# EasyEDA schematic SCH_LedGridWallHatV4_2026-08-28.json
TITLE: LED GRID WALL HAT; REV: 0.2; Date: 2026-05-31; Sheet: 1/1; Company: TimmonsLee
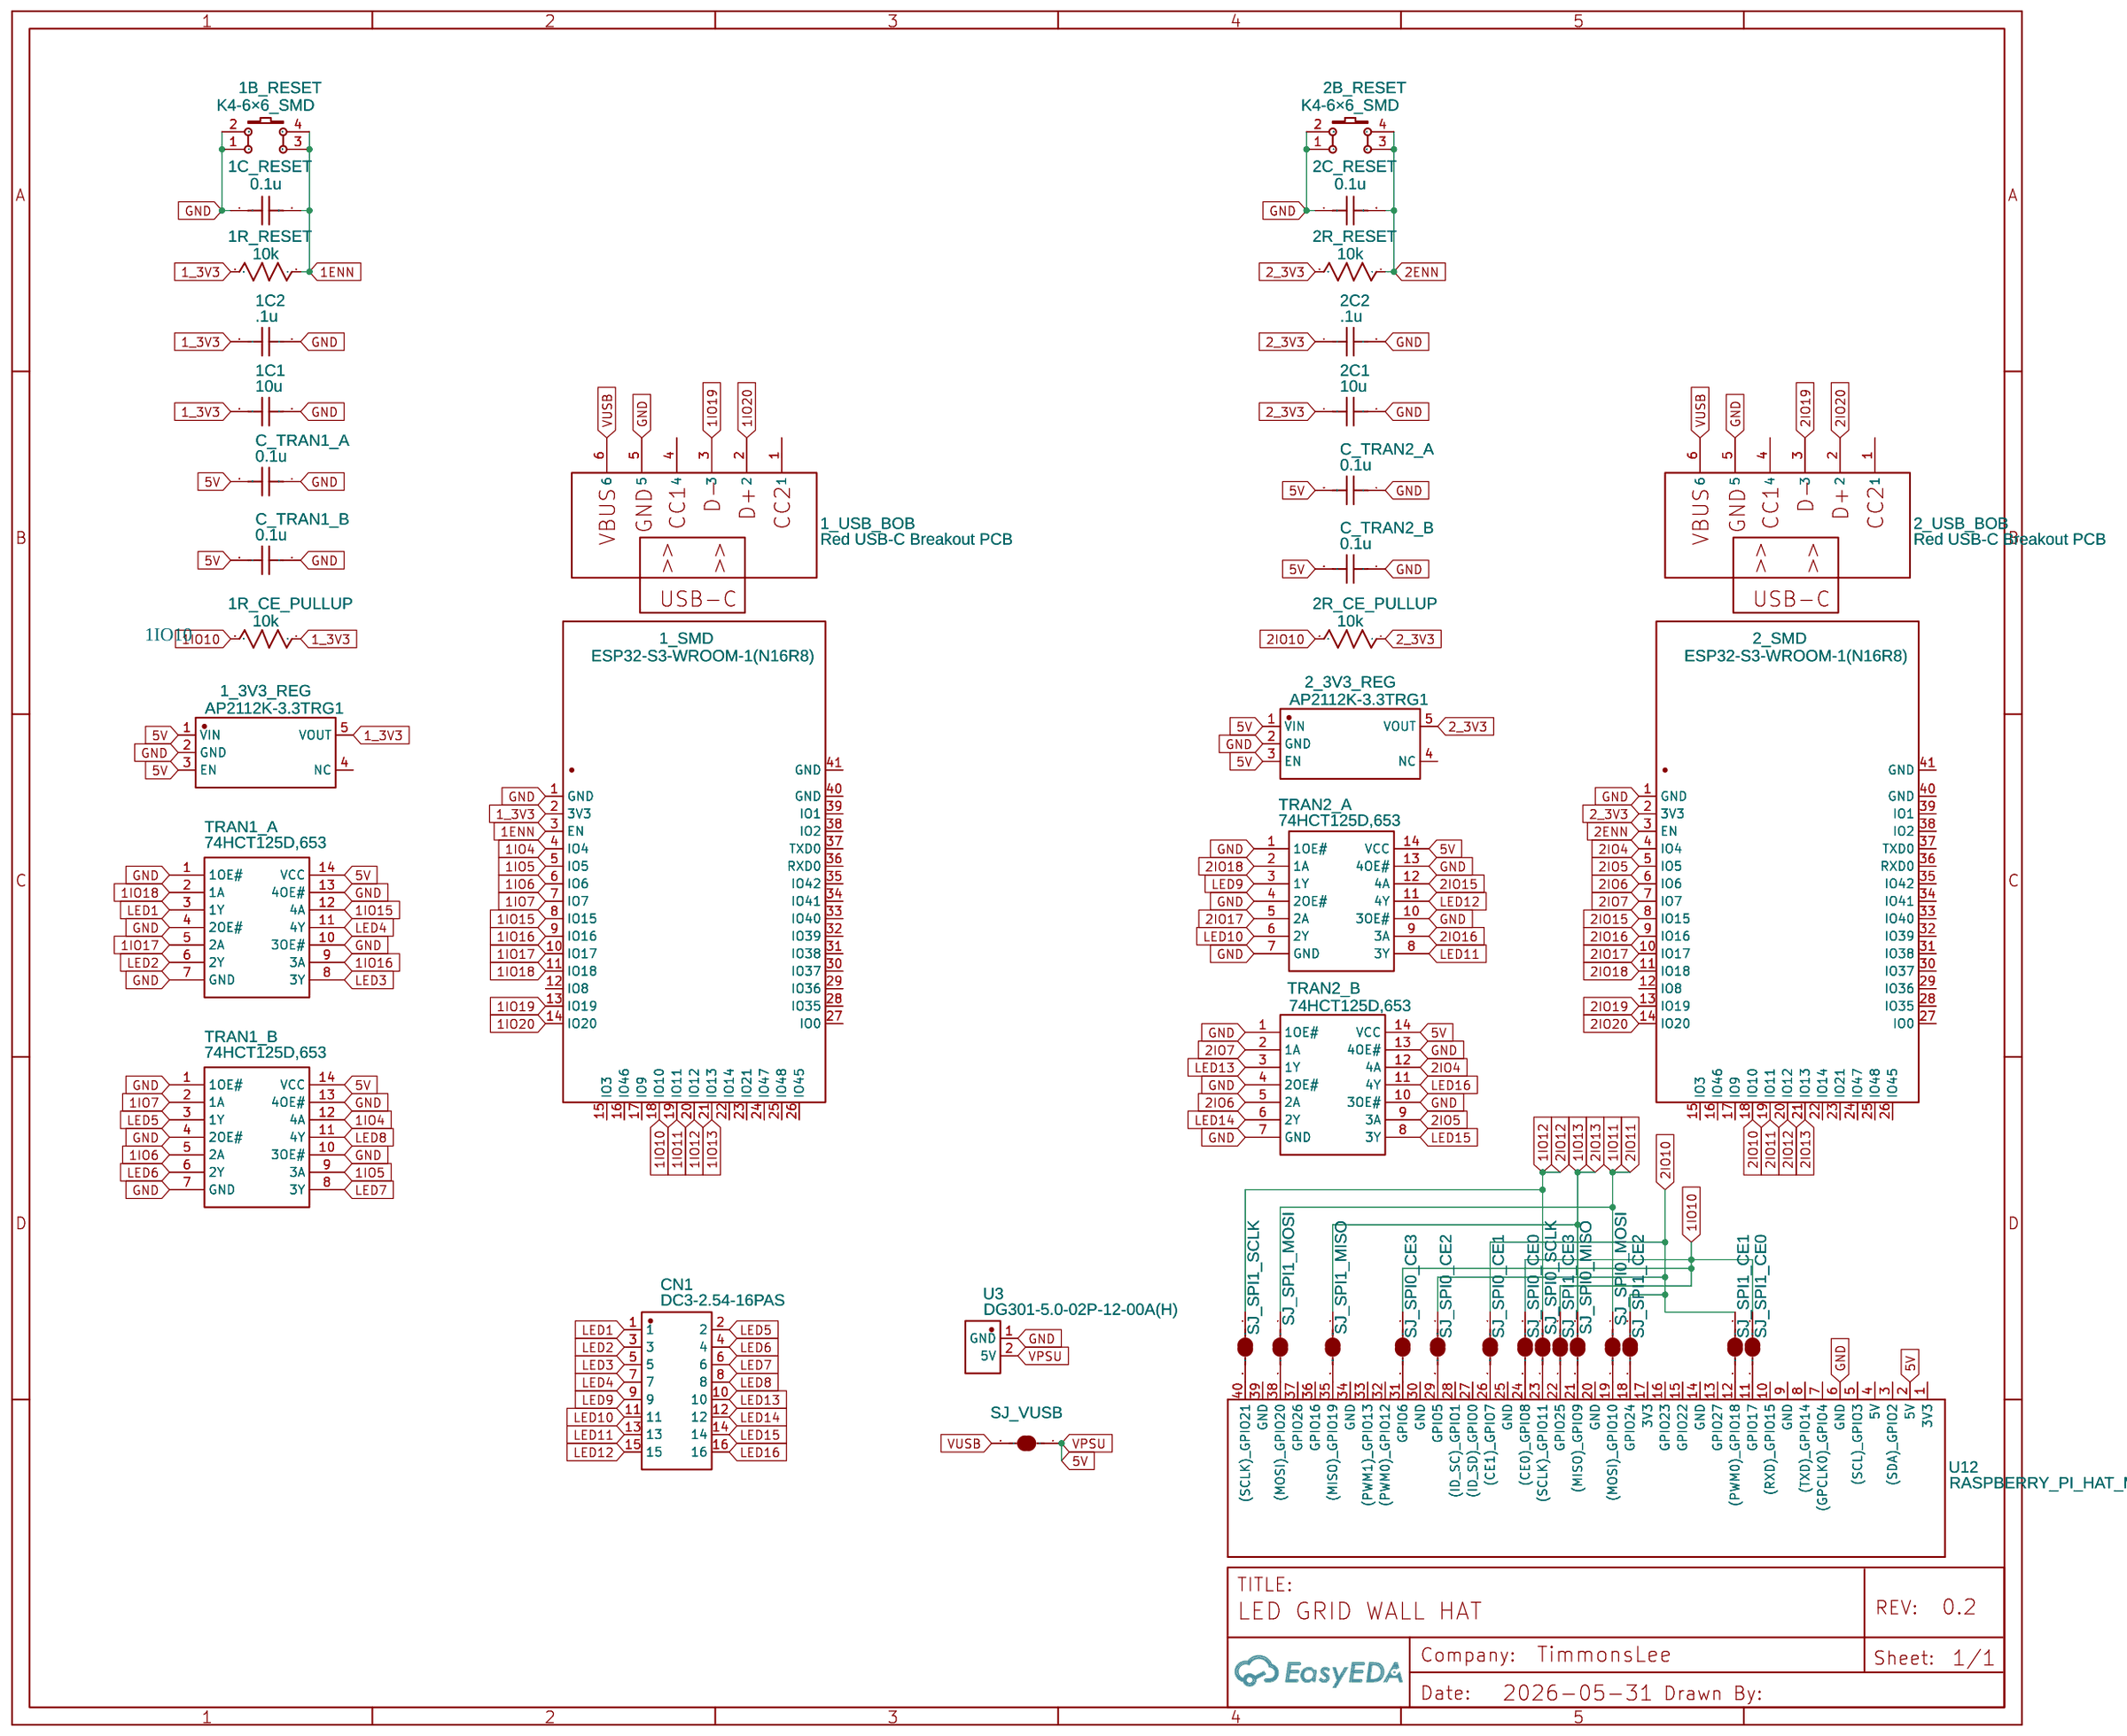
[diagram p0: schematic sheet]

## Parts
1_3V3_REG  AP2112K-3.3TRG1  [SOT-25-5_L2.9-W1.6-P0.95-LS2.8-BL]
1_SMD  ESP32-S3-WROOM-1(N16R8)  [WIRELM-SMD_ESP32-S3-WROOM-1]
1_USB_BOB  Red USB-C Breakout PCB  [RED USB-C BREAKOUT]
1B_RESET  K4-6×6_SMD  [KEY-SMD_4P-L6.0-W6.0-P3.90-LS10.0]
1C1  10u  [C1206]
1C2  .1u  [C1206]
1C_RESET  0.1u  [C1206]
1R_CE_PULLUP  10k  [R1206]
1R_RESET  10k  [R1206]
2_3V3_REG  AP2112K-3.3TRG1  [SOT-25-5_L2.9-W1.6-P0.95-LS2.8-BL]
2_SMD  ESP32-S3-WROOM-1(N16R8)  [WIRELM-SMD_ESP32-S3-WROOM-1]
2_USB_BOB  Red USB-C Breakout PCB  [RED USB-C BREAKOUT]
2B_RESET  K4-6×6_SMD  [KEY-SMD_4P-L6.0-W6.0-P3.90-LS10.0]
2C1  10u  [C1206]
2C2  .1u  [C1206]
2C_RESET  0.1u  [C1206]
2R_CE_PULLUP  10k  [R1206]
2R_RESET  10k  [R1206]
C_TRAN1_A  0.1u  [C1206]
C_TRAN1_B  0.1u  [C1206]
C_TRAN2_A  0.1u  [C1206]
C_TRAN2_B  0.1u  [C1206]
CN1  DC3-2.54-16PAS  [IDC-TH_16P-P2.54_C3406]
SJ_SPI0_CE0  SOLDERJUMPERNO  [SJ_2S-NO]
SJ_SPI0_CE1  SOLDERJUMPERNO  [SJ_2S-NO]
SJ_SPI0_CE2  SOLDERJUMPERNO  [SJ_2S-NO]
SJ_SPI0_CE3  SOLDERJUMPERNO  [SJ_2S-NO]
SJ_SPI0_MISO  SOLDERJUMPERNO  [SJ_2S-NO]
SJ_SPI0_MOSI  SOLDERJUMPERNO  [SJ_2S-NO]
SJ_SPI0_SCLK  SOLDERJUMPERNO  [SJ_2S-NO]
SJ_SPI1_CE0  SOLDERJUMPERNO  [SJ_2S-NO]
SJ_SPI1_CE1  SOLDERJUMPERNO  [SJ_2S-NO]
SJ_SPI1_CE2  SOLDERJUMPERNO  [SJ_2S-NO]
SJ_SPI1_CE3  SOLDERJUMPERNO  [SJ_2S-NO]
SJ_SPI1_MISO  SOLDERJUMPERNO  [SJ_2S-NO]
SJ_SPI1_MOSI  SOLDERJUMPERNO  [SJ_2S-NO]
SJ_SPI1_SCLK  SOLDERJUMPERNO  [SJ_2S-NO]
SJ_VUSB  SOLDERJUMPERNO  [SJ_2S-NO]
TRAN1_A  74HCT125D,653  [SOIC-14_L8.7-W3.9-P1.27-LS6.0-BL]
TRAN1_B  74HCT125D,653  [SOIC-14_L8.7-W3.9-P1.27-LS6.0-BL]
TRAN2_A  74HCT125D,653  [SOIC-14_L8.7-W3.9-P1.27-LS6.0-BL]
TRAN2_B  74HCT125D,653  [SOIC-14_L8.7-W3.9-P1.27-LS6.0-BL]
U3  DG301-5.0-02P-12-00A(H)  [CONN-TH_DEGSON_DG301-5.0-02P]
U12  RASPBERRY_PI_HAT_MIRROR  [RASPBERRYPI_HAT]

## Library data of the parts
1_3V3_REG 2_3V3_REG = AP2112K-3.3TRG1: Contributor: LCSC; Supplier: LCSC; Manufacturer: DIODES(美台); Supplier Part: C51118; JLCPCB Part Class: Extended Part
1_SMD 2_SMD = ESP32-S3-WROOM-1(N16R8): Contributor: lcsc; Supplier: LCSC; Supplier Part: C2913202; Manufacturer: ESPRESSIF(乐鑫); Manufacturer Part: ESP32-S3-WROOM-1-N16R8; JLCPCB Part Class: Extended Part
1_USB_BOB 2_USB_BOB = Red USB-C Breakout PCB: Supplier: AliExpress; link: https://www.aliexpress.com/item/1005005603761138.html; Contributor: Dmytro Mazur
1B_RESET 2B_RESET = K4-6×6_SMD: Supplier Part: C191626; Supplier: LCSC; Manufacturer: 韩国韩荣; Manufacturer Part: K2-6639SP-D4SC-04; Contributor: LCEDA_Lib
1C1 1C2 1C_RESET 2C1 2C2 2C_RESET C_TRAN1_A C_TRAN1_B C_TRAN2_A C_TRAN2_B = C_1206_US: Contributor: LCEDA_Lib
1R_CE_PULLUP 1R_RESET 2R_CE_PULLUP 2R_RESET = R_1206_US: Contributor: LCEDA_Lib
CN1 = DC3-2.54-16PAS: Contributor: lcsc; Supplier: LCSC; Supplier Part: C2977594; Manufacturer: ZHOURI(洲日); JLCPCB Part Class: Extended Part
SJ_SPI0_CE0-SJ_SPI0_CE3 SJ_SPI0_MISO SJ_SPI0_MOSI SJ_SPI0_SCLK SJ_SPI1_CE0-SJ_SPI1_CE3 SJ_SPI1_MISO SJ_SPI1_MOSI SJ_SPI1_SCLK SJ_VUSB = SOLDERJUMPERNO: Solder Jumper; Contributor: SparkFun
TRAN1_A TRAN1_B TRAN2_A TRAN2_B = 74HCT125D,653: Supplier: LCSC; Manufacturer: Nexperia(安世); Supplier Part: C5962; JLCPCB Part Class: Extended Part
U3 = DG301-5.0-02P-12-00A(H): Supplier: LCSC; Supplier Part: C5371917; Manufacturer: DEGSON(高正/高松); JLCPCB Part Class: Extended Part; Contributor: lcsc
U12 = RASPBERRY_PI_HAT_MIRROR: Manufacturer Part: RaspberryPi 3; Contributor: lynxlabeling

## Nets
5V: 1_3V3_REG.1(VIN) 1_3V3_REG.3(EN) 2_3V3_REG.1(VIN) 2_3V3_REG.3(EN) C_TRAN1_A.2 C_TRAN1_B.2 C_TRAN2_A.2 C_TRAN2_B.2 SJ_VUSB.1 TRAN1_A.14(VCC) TRAN1_B.14(VCC) TRAN2_A.14(VCC) TRAN2_B.14(VCC) U3.2(5V) U12.2(5V)
GND: 1_3V3_REG.2(GND) 1_SMD.1(GND) 1_USB_BOB.5 1B_RESET.1 1B_RESET.2 1C1.2 1C2.2 1C_RESET.1 2_3V3_REG.2(GND) 2_SMD.1(GND) 2_USB_BOB.5 2B_RESET.1 2B_RESET.2 2C1.2 2C2.2 2C_RESET.1 C_TRAN1_A.1 C_TRAN1_B.1 C_TRAN2_A.1 C_TRAN2_B.1 TRAN1_A.1(1OE#) TRAN1_A.4(2OE#) TRAN1_A.7(GND) TRAN1_A.10(3OE#) TRAN1_A.13(4OE#) TRAN1_B.1(1OE#) TRAN1_B.4(2OE#) TRAN1_B.7(GND) TRAN1_B.10(3OE#) TRAN1_B.13(4OE#) TRAN2_A.1(1OE#) TRAN2_A.4(2OE#) TRAN2_A.7(GND) TRAN2_A.10(3OE#) TRAN2_A.13(4OE#) TRAN2_B.1(1OE#) TRAN2_B.4(2OE#) TRAN2_B.7(GND) TRAN2_B.10(3OE#) TRAN2_B.13(4OE#) U3.1(GND) U12.6(GND)
1_3V3: 1_3V3_REG.5(VOUT) 1_SMD.2(3V3) 1C1.1 1C2.1 1R_CE_PULLUP.1 1R_RESET.2
1ENN: 1_SMD.3(EN) 1B_RESET.3 1B_RESET.4 1C_RESET.2 1R_RESET.1
1IO4: 1_SMD.4(IO4) TRAN1_B.12(4A)
1IO5: 1_SMD.5(IO5) TRAN1_B.9(3A)
1IO6: 1_SMD.6(IO6) TRAN1_B.5(2A)
1IO7: 1_SMD.7(IO7) TRAN1_B.2(1A)
1IO10: 1_SMD.18(IO10) 1R_CE_PULLUP.2 SJ_SPI0_CE0.1 SJ_SPI0_CE3.1 SJ_SPI1_CE0.1 SJ_SPI1_CE3.1
1IO11: 1_SMD.19(IO11) 2_SMD.19(IO11) SJ_SPI0_MOSI.1 SJ_SPI1_MOSI.1
1IO12: 1_SMD.20(IO12) 2_SMD.20(IO12) SJ_SPI0_SCLK.1 SJ_SPI1_SCLK.1
1IO13: 1_SMD.21(IO13) 2_SMD.21(IO13) SJ_SPI0_MISO.1 SJ_SPI1_MISO.1
1IO15: 1_SMD.8(IO15) TRAN1_A.12(4A)
1IO16: 1_SMD.9(IO16) TRAN1_A.9(3A)
1IO17: 1_SMD.10(IO17) TRAN1_A.5(2A)
1IO18: 1_SMD.11(IO18) TRAN1_A.2(1A)
1IO19: 1_SMD.13(IO19) 1_USB_BOB.3
1IO20: 1_SMD.14(IO20) 1_USB_BOB.2
2_3V3: 2_3V3_REG.5(VOUT) 2_SMD.2(3V3) 2C1.1 2C2.1 2R_CE_PULLUP.1 2R_RESET.2
2ENN: 2_SMD.3(EN) 2B_RESET.3 2B_RESET.4 2C_RESET.2 2R_RESET.1
2IO4: 2_SMD.4(IO4) TRAN2_B.12(4A)
2IO5: 2_SMD.5(IO5) TRAN2_B.9(3A)
2IO6: 2_SMD.6(IO6) TRAN2_B.5(2A)
2IO7: 2_SMD.7(IO7) TRAN2_B.2(1A)
2IO10: 2_SMD.18(IO10) 2R_CE_PULLUP.2 SJ_SPI0_CE1.1 SJ_SPI0_CE2.1 SJ_SPI1_CE1.1 SJ_SPI1_CE2.1
2IO15: 2_SMD.8(IO15) TRAN2_A.12(4A)
2IO16: 2_SMD.9(IO16) TRAN2_A.9(3A)
2IO17: 2_SMD.10(IO17) TRAN2_A.5(2A)
2IO18: 2_SMD.11(IO18) TRAN2_A.2(1A)
2IO19: 2_SMD.13(IO19) 2_USB_BOB.3
2IO20: 2_SMD.14(IO20) 2_USB_BOB.2
LED1: CN1.1 TRAN1_A.3(1Y)
LED2: CN1.3 TRAN1_A.6(2Y)
LED3: CN1.5 TRAN1_A.8(3Y)
LED4: CN1.7 TRAN1_A.11(4Y)
LED5: CN1.2 TRAN1_B.3(1Y)
LED6: CN1.4 TRAN1_B.6(2Y)
LED7: CN1.6 TRAN1_B.8(3Y)
LED8: CN1.8 TRAN1_B.11(4Y)
LED9: CN1.9 TRAN2_A.3(1Y)
LED10: CN1.11 TRAN2_A.6(2Y)
LED11: CN1.13 TRAN2_A.8(3Y)
LED12: CN1.15 TRAN2_A.11(4Y)
LED13: CN1.10 TRAN2_B.3(1Y)
LED14: CN1.12 TRAN2_B.6(2Y)
LED15: CN1.14 TRAN2_B.8(3Y)
LED16: CN1.16 TRAN2_B.11(4Y)
VUSB: 1_USB_BOB.6 2_USB_BOB.6 SJ_VUSB.2
Net-(SJ_SPI0_CE0-2): SJ_SPI0_CE0.2 U12.24((CE0) GPIO8)
Net-(SJ_SPI0_CE1-2): SJ_SPI0_CE1.2 U12.26((CE1) GPIO7)
Net-(SJ_SPI0_CE2-2): SJ_SPI0_CE2.2 U12.29(GPIO5)
Net-(SJ_SPI0_CE3-2): SJ_SPI0_CE3.2 U12.31(GPIO6)
Net-(SJ_SPI0_MISO-2): SJ_SPI0_MISO.2 U12.21((MISO) GPIO9)
Net-(SJ_SPI0_MOSI-2): SJ_SPI0_MOSI.2 U12.19((MOSI) GPIO10)
Net-(SJ_SPI0_SCLK-2): SJ_SPI0_SCLK.2 U12.23((SCLK) GPIO11)
Net-(SJ_SPI1_CE0-2): SJ_SPI1_CE0.2 U12.11(GPIO17)
Net-(SJ_SPI1_CE1-2): SJ_SPI1_CE1.2 U12.12((PWM0) GPIO18)
Net-(SJ_SPI1_CE2-2): SJ_SPI1_CE2.2 U12.18(GPIO24)
Net-(SJ_SPI1_CE3-2): SJ_SPI1_CE3.2 U12.22(GPIO25)
Net-(SJ_SPI1_MISO-2): SJ_SPI1_MISO.2 U12.35((MISO) GPIO19)
Net-(SJ_SPI1_MOSI-2): SJ_SPI1_MOSI.2 U12.38((MOSI) GPIO20)
Net-(SJ_SPI1_SCLK-2): SJ_SPI1_SCLK.2 U12.40((SCLK) GPIO21)

Not connected (* = marked no-connect by the designer): 1_3V3_REG 4(NC); 1_SMD 12(IO8) 15(IO3) 16(IO46) 17(IO9) 22(IO14) 23(IO21) 24(IO47) 25(IO48) 26(IO45) 27(IO0) 28(IO35) 29(IO36) 30(IO37) 31(IO38) 32(IO39) 33(IO40) 34(IO41) 35(IO42) 36(RXD0) 37(TXD0) 38(IO2) 39(IO1) 40(GND) 41(GND); 1_USB_BOB 1 4; 2_3V3_REG 4(NC); 2_SMD 12(IO8) 15(IO3) 16(IO46) 17(IO9) 22(IO14) 23(IO21) 24(IO47) 25(IO48) 26(IO45) 27(IO0) 28(IO35) 29(IO36) 30(IO37) 31(IO38) 32(IO39) 33(IO40) 34(IO41) 35(IO42) 36(RXD0) 37(TXD0) 38(IO2) 39(IO1) 40(GND) 41(GND); 2_USB_BOB 1 4; U12 1(3V3) 3((SDA) GPIO2) 4(5V) 5((SCL) GPIO3) 7((GPCLK0) GPIO4) 8((TXD) GPIO14) 9(GND) 10((RXD) GPIO15) 13(GPIO27) 14(GND) 15(GPIO22) 16(GPIO23) 17(3V3) 20(GND) 25(GND) 27((ID_SD) GPIO0) 28((ID_SC) GPIO1) 30(GND) 32((PWM0) GPIO12) 33((PWM1) GPIO13) 34(GND) 36(GPIO16) 37(GPIO26) 39(GND)

## Notes on the sheet
- 1IO10
